# Altium schematic sheet HLib-Comm-XBee.SchDoc
size A
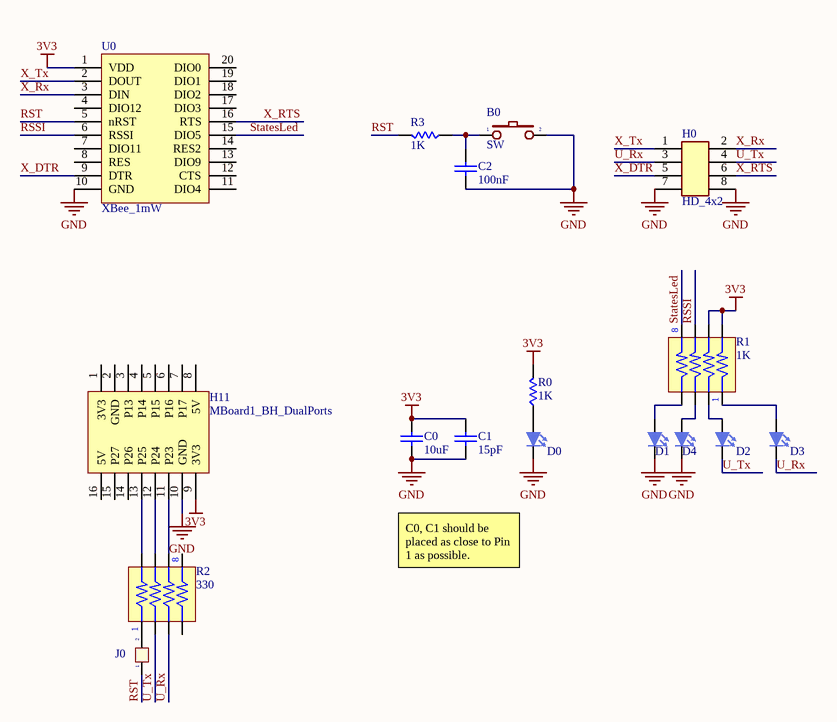
[diagram p0: HLib-Comm-XBee.SchDoc]

## Parts
B0  SW  [SW2SMD]
C0  value 10uF  [SM_0805_C_CERAMIC]  (hidden comment: C_Ceramic)
C1  value 15pF  [SM_0805_C_CERAMIC]  (hidden comment: C_Ceramic)
C2  value 100nF  [SM_0805_C_CERAMIC]  (hidden comment: C_Ceramic)
D0  LED  [SM_0805_LED]  (value not drawn)
D1  LED  [SM_0805_LED]  (value not drawn)
D2  LED  [SM_0805_LED]  (value not drawn)
D3  LED  [SM_0805_LED]  (value not drawn)
D4  LED  [SM_0805_LED]  (value not drawn)
H0  HD_4x2  [HD_male_4x2_100mil_straight]
H11  MBoard1_BH_DualPorts  [MBoard1_BH_DualPorts]
J0  Jumper 2  [J2]  (value not drawn)
R0  value 1K  [SM_0805_R]  (hidden comment: R)
R1  1K  [RA4]
R2  330  [RA4]
R3  value 1K  [SM_0805_R]  (hidden comment: R)
U0  XBee_1mW  [XBee]

## Nets
3V3: C0.2 C1.2 H11.9(3V3) R0.2 R1.2 R1.4 U0.1(VDD)
GND: B0.2 C0.1 C1.1 C2.1 D0.2(K) D1.2(K) D4.2(K) H0.7 H0.8 H11.10(GND) U0.10(GND)
RSSI: R1.6 U0.6(RSSI)
RST: J0.1 R3.2 U0.5(nRST)
StatesLed: R1.8 U0.15(DIO5)
U_Rx: D3.2(K) H0.3 R2.5
U_Tx: D2.2(K) H0.4 R2.3
X_DTR: H0.5 U0.9(DTR)
X_RTS: H0.6 U0.16(RTS)
X_Rx: H0.2 U0.3(DIN)
X_Tx: H0.1 U0.2(DOUT)
NetB0_1: B0.1 C2.2 R3.1
NetD0_1: D0.1(A) R0.1
NetD1_1: D1.1(A) R1.7
NetD2_1: D2.1(A) R1.3
NetD3_1: D3.1(A) R1.1
NetD4_1: D4.1(A) R1.5
NetH11_11: H11.11(P23) R2.6
NetH11_12: H11.12(P24) R2.4
NetH11_13: H11.13(P25) R2.2
NetJ0_2: J0.2 R2.1

Not connected (* = marked no-connect by the designer): H11 1(3V3) 2(GND) 3(P13) 4(P14) 5(P15) 6(P16) 7(P17) 8(5V) 14(P26) 15(P27) 16(5V); R2 7 8; U0 4(DIO12) 7(DIO11) 8(RES) 11(DIO4) 12(CTS) 13(DIO9) 14(RES2) 17(DIO3) 18(DIO2) 19(DIO1) 20(DIO0)

## Notes on the sheet
- C0, C1 should be placed as close to Pin 1 as possible.

## Library data of the parts
B0 = SW2: Switch button 2 pin; Value: SW chip 2 pin
C0-C2 = C_Ceramic: Non-polarity ceramic capacitor; Published: 8-Jun-2000; LatestRevisionDate: 17-Jul-2002; LatestRevisionNote: Re-released for DXP Platform.; PackageReference: RAD-0.3; Publisher: Altium Limited; PackageDescription: Radial Cap, Thru-Hole; 2 Leads; 0.3 in Pin Spacing
H0 = HD_4x2: Header, 4-pins/row, double row,
J0 = JP 2: Value: JP 2
R0 R3 = R: Resistor; Published: 8-Jun-2000; LatestRevisionDate: 29-May-2009; LatestRevisionNote: IPC-7351 Footprint Added.; PackageReference: J1-0603; Publisher: Altium Limited; PackageDescription: Chip Resistor
R1 R2 = RA4
D0-D4 = LED: Published: 8-Jun-2000; LatestRevisionDate: 08-Jul-2005; LatestRevisionNote: Mech Layer 1 removed.; PackageReference: LED-1; Publisher: Altium Limited; PackageDescription: LED; 2 Leads